# Altium schematic sheet eps_flash.SchDoc
size A4
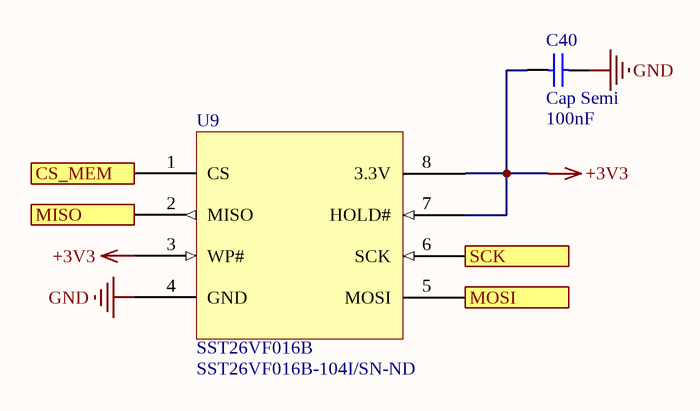
[diagram p0: eps_flash.SchDoc]

## Parts
C40  Cap Semi  value 100nF  [1608[0603]]
U9  SST26VF016B  Supplier Part Number 1: SST26VF016B-104I/SN-ND  [SOIC127P500X600-8N]

## Ports
CS_MEM (in), MISO (out), MOSI (in), SCK (in)

## Nets
+3V3: C40.1 U9.3(WP#) U9.7(HOLD#) U9.8(3.3V)
GND: C40.2 U9.4(GND)
CS_MEM: U9.1(CS) ; port CS_MEM
MISO: U9.2(MISO) ; port MISO
MOSI: U9.5(MOSI) ; port MOSI
SCK: U9.6(SCK) ; port SCK

## Library data of the parts
C40 = Cap Semi: Capacitor (Semiconductor SIM Model); Published: 8-Jun-2000; LatestRevisionDate: 29-May-2009; LatestRevisionNote: IPC-7351 Footprint Added.; PackageReference: C1206; Publisher: Altium Limited; PackageDescription: Chip Capacitor
U9 = SST26VF016B: 2.5V/3.0V 16 Mbit Serial Quad I/O (SQI) Flash Memory; ComponentLink1Description: SST25VF016B; ComponentLink1URL: https://www.digikey.ca/product-detail/en/microchip-technology/SST26VF016B-104I-SN/SST26VF016B-104I-SN-ND/5033651; Supplier 1: Digi-Key